# Altium schematic sheet Retificador.SchDoc
size A4
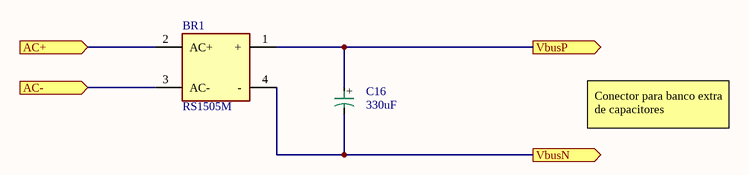
[diagram p0: Retificador.SchDoc]

## Parts
BR1  RS1505M  [RS1505M_BOT]
C16  value 330uF  [CAP ALU D30 A50]  (hidden comment: Cap 30x50 mm)

## Ports
AC+ (in), AC- (in), VbusN (out), VbusP (out)

## Nets
AC+: BR1.2(AC+) ; port AC+
AC-: BR1.3(AC-) ; port AC-
VbusN: BR1.4(-) C16.2 ; port VbusN
VbusP: BR1.1(+) C16.1 ; port VbusP

## Notes on the sheet
- Conector para banco extra de capacitores
- (in symbol Capacitor ALU 30x50 mm) +

## Library data of the parts
BR1 = RS1505M: Bridge Rectifier; Manufacturer_Name: Rectron; Datasheet Link: https://www.arrow.com/en/products/rs1505m/rectron; Height: 20.3mm; Manufacturer_Part_Number: RS1505M; Mouser Part Number: 583-RS1505M; Mouser Price/Stock: https://www.mouser.com/Search/Refine.aspx?Keyword=583-RS1505M; Arrow Part Number: RS1505M; Arrow Price/Stock: https://www.arrow.com/en/products/rs1505m/rectron
C16 = Capacitor ALU 30x50 mm: Capacitor 30x50 mm; %: ±20%; Tensão: 200V